# Altium project LM-003.PrjPcb (part 1 of 4)
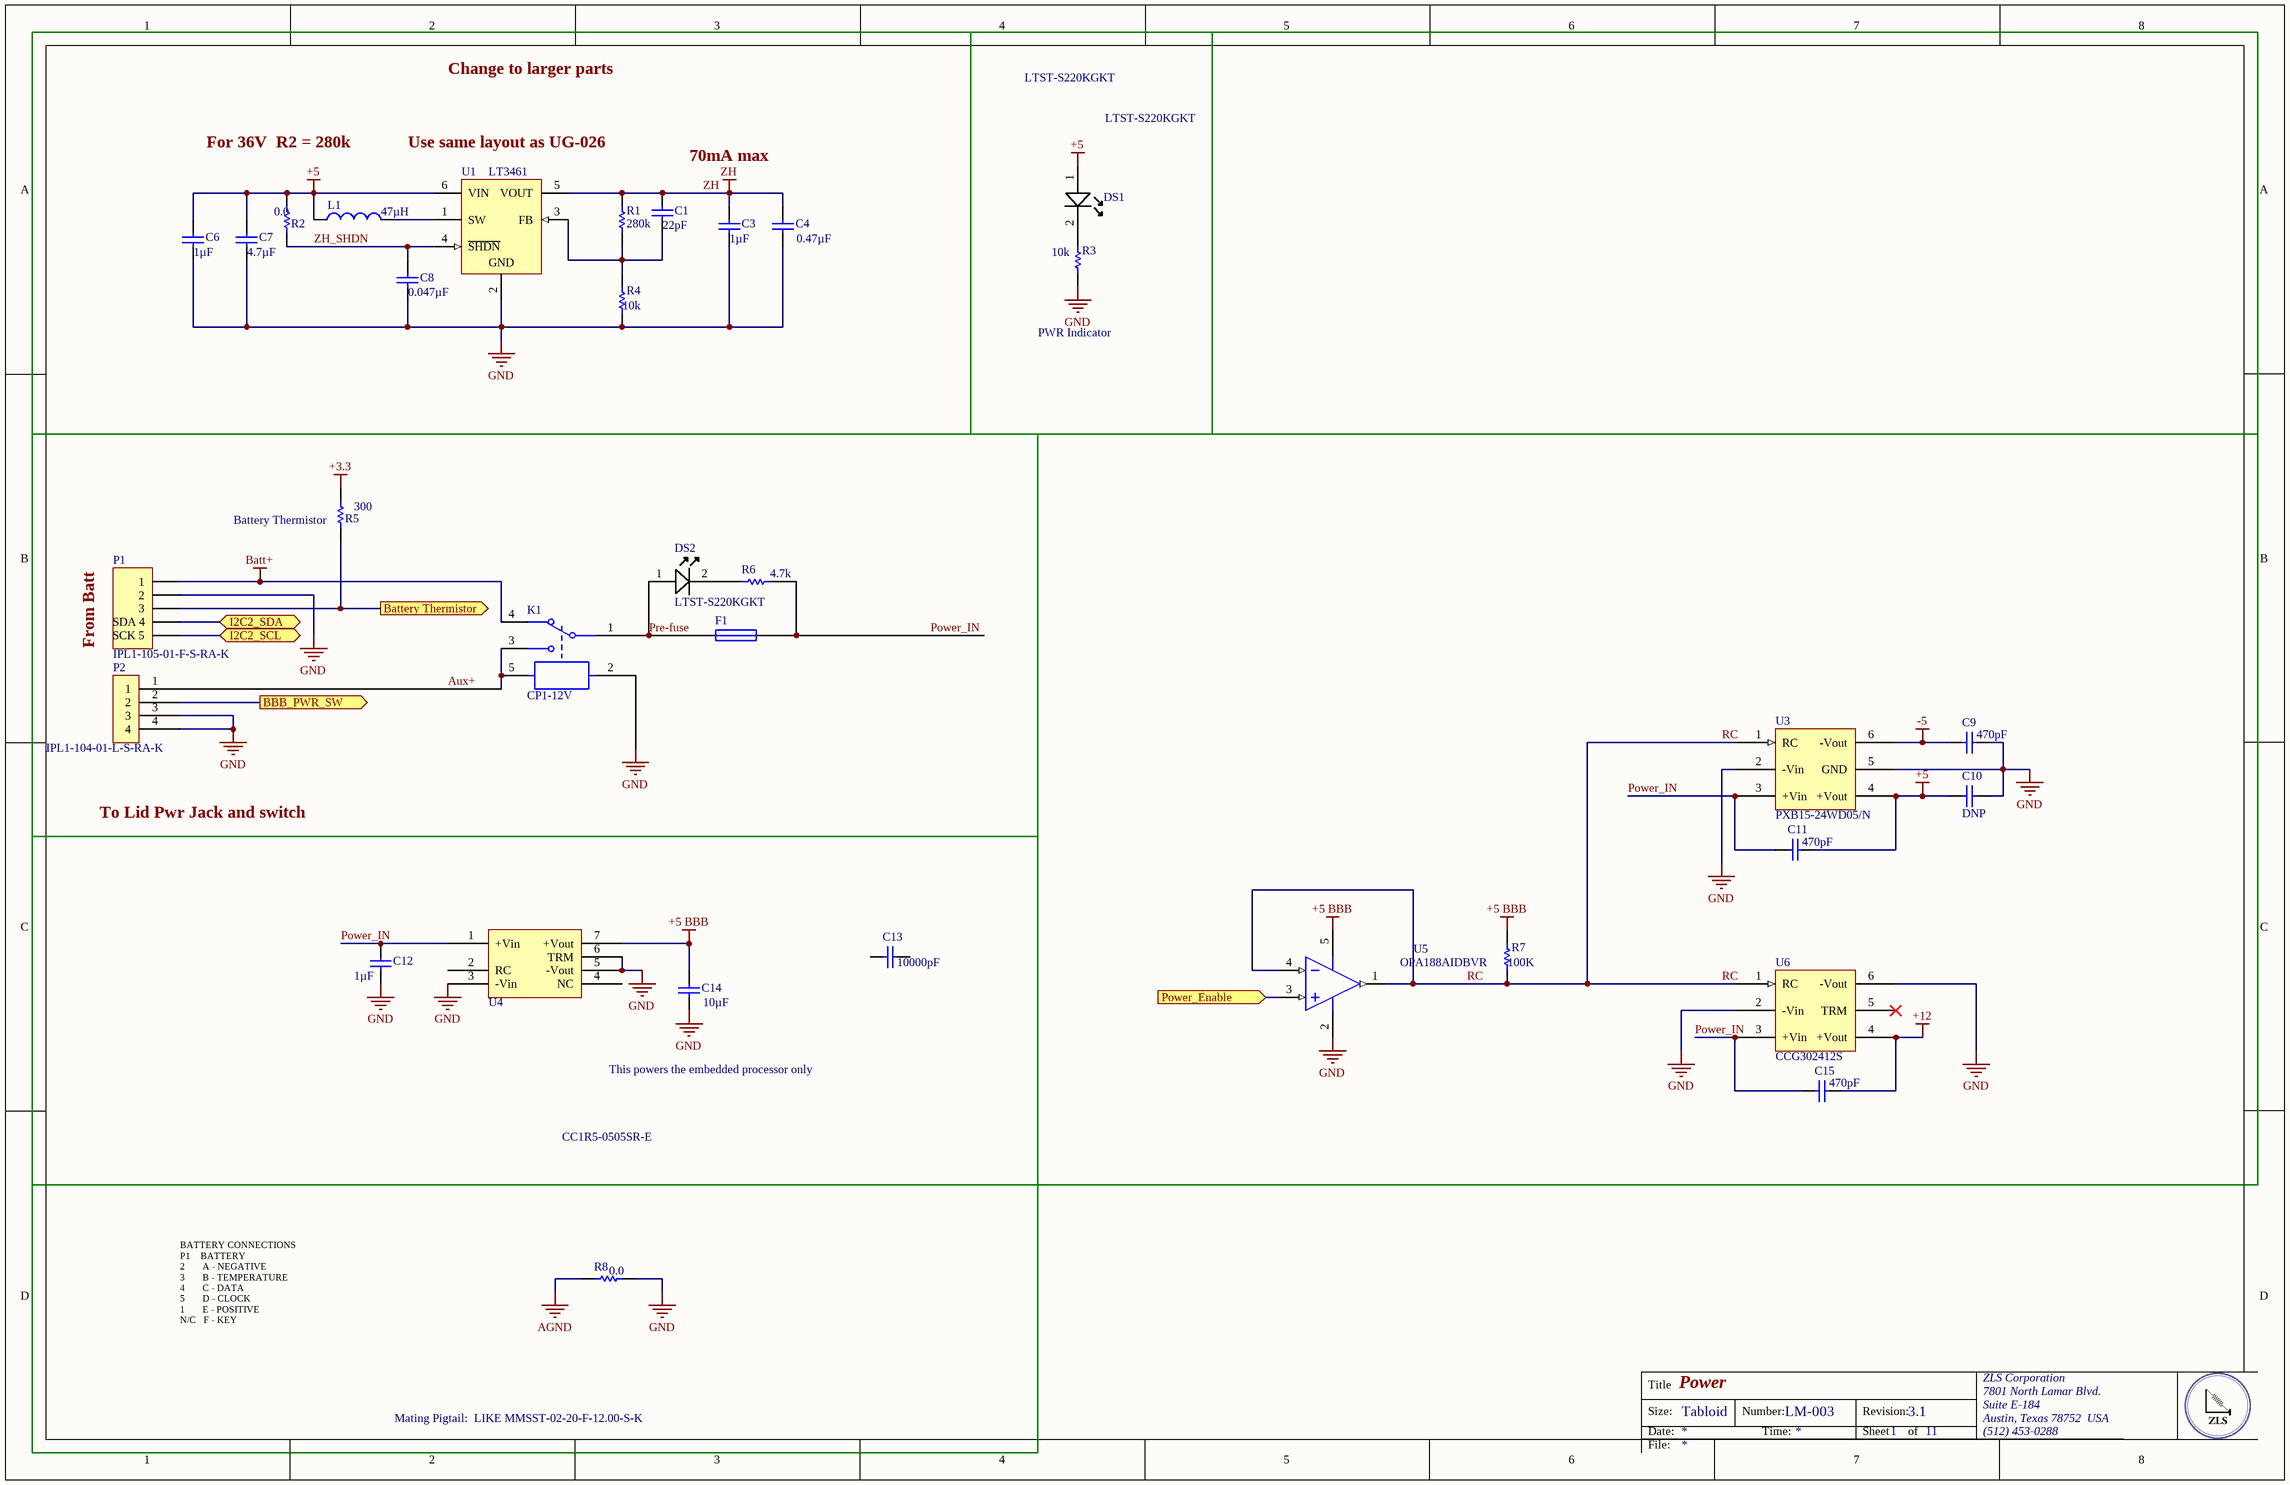
[diagram p0: Power.SchDoc]
9 sheets, 176 parts. Net scope: flat (ports and power ports of the same name join across sheets).
Board file: LM-003.PcbDoc
Sheets:
  Power.SchDoc
  FeedbackLoop.SchDoc
  ADC.SchDoc
  BBB Headers.SchDoc
  Connectors.SchDoc
  heater_control.SchDoc
  Power Monitor.SchDoc
  Real Time Clock.SchDoc
  RS232.SchDoc

## Sheet Power.SchDoc: Power
size Tabloid; DocumentNumber: LM-003; Revision: 3.1; SheetNumber: 1; SheetTotal: 11

### Parts
(Parts that share a designator on the sheet are numbered #1, #2 ... from top to bottom, then left to right.)
C1  Capacitance: 22pF  [CAPC0603(1608)100_N]  (hidden comment: CAP CER 22PF 50V X7R 0603)
C3  Capacitance: 1µF  [CAPC1210(3225)100_N]  (hidden comment: CAP CER 1UF 50V X7R 1210)
C4  Capacitance: 0.47µF  [CAPC1206(3216)190_N]  (hidden comment: CAP CER 0.47UF 50V X7R 1206)
C6  Capacitance: 1µF  [CAPC0805(2012)145_N]  (hidden comment: CAP CER 1UF 16V X7R 0805)
C7  Capacitance: 4.7µF  [CAPC1206(3216)130_N]  (hidden comment: CAP CER 4.7UF 16V X7R 1206)
C8  Capacitance: 0.047µF  [CAPC0805(2012)145_N]  (hidden comment: CAP CER 0.047UF 16V X7R 0603)
C9  Capacitance: 470pF  [CAPC1812(4532)230_M]  (hidden comment: CAP CER 470PF 3KV X7R 1812)
C10  DNP  [CAPC1812(4532)230_M]
C11  Capacitance: 470pF  [CAPC1812(4532)230_M]  (hidden comment: CAP CER 470PF 3KV X7R 1812)
C12  Capacitance: 1µF  [CAPC1210(3225)100_L]  (hidden comment: CAP CER 1UF 50V X7R 1210)
C13  Capacitance: 10000pF  [CAPC0805(2012)145_N]  (hidden comment: CAP CER 10000PF 25V X7R 0805)
C14#1  Capacitance: 10µF  [CAPC0805(2012)145_N]  (hidden comment: CAP CER 10UF 10V X7R 0805)
C15#1  Capacitance: 470pF  [CAPC1812(4532)230_M]  (hidden comment: CAP CER 470PF 3KV X7R 1812)
DS1  Manufacturer Part Number: LTST-S220KGKT  [0805C_L]  (hidden comment: Lite-On LTST-S220KGKT Green LED, 571 nm 2012 (0805) Side View, Rectangle Lens SMD package)
DS2  Manufacturer Part Number: LTST-S220KGKT  [0805C_L]  (hidden comment: Lite-On LTST-S220KGKT Green LED, 571 nm 2012 (0805) Side View, Rectangle Lens SMD package)
F1  Fuse 1  [PIN-W2/E2.8]  (value not drawn)
K1  CP1-12V  [PNSC-CP1-12V_V]
L1  Inductance: 47µH  [0402-A]  (hidden comment: FIXED IND 47UH 170MA 1.3 OHM SMD)
P1  IPL1-105-01-F-S-RA-K  [IPL1-105-1]
P2  IPL1-104-01-L-S-RA-K  [IPL1-104-01]
R1  Resistance (Ohms): 280k  [RESC0805(2012)_M]  (hidden comment: RES SMD 280K OHM 1% 1/8W 0805)
R2  Resistance (Ohms): 0.0  [RESC0805(2012)_M]  (hidden comment: RES SMD 0.0 OHM JUMPER 1/8W 0805)
R3  Resistance (Ohms): 10k  [RESC0805(2012)_M]  (hidden comment: RES SMD 10K OHM 1% 1/8W 0805)
R4  Resistance (Ohms): 10k  [RESC0805(2012)_M]  (hidden comment: RES SMD 10K OHM 1% 1/8W 0805)
R5  Resistance (Ohms): 300  [RESC0805(2012)_M]  (hidden comment: 300K 5% 0805(2012))
R6  Resistance (Ohms): 4.7k  [RESC0805(2012)_M]  (hidden comment: RES SMD 4.7K OHM 1% 1/8W 0805)
R7  Resistance: 100K  [RESC0805(2012)_M]  (hidden comment: RES SMD 100K OHM 1% 1/8W 0805)
R8  Resistance (Ohms): 0.0  [RESC0805(2012)_M]  (hidden comment: RES SMD 0.0 OHM JUMPER 1/8W 0805)
U1  LT3461  [LT-S6-6-TSOT-23_N]
U3  PXB15-24WD05/N  [PXB15-24WD05/N]
U4  CC1R5-0505SR-E  [CC1R5-0505SR-E]  (value not drawn)
U5  OPA188AIDBVR  [DBV0005A_M]
U6#1  CCG302412S  [CCG30]

### Blocks framed on the sheet
From Batt: DS2 F1 K1 P1 P2 R5 R6
To Lid Pwr Jack and switch: C12 C13 C14#1 U4
Mating Pigtail:  LIKE MMSST-02-20-F-12.00-S-K: R8

### Ports
Battery Thermistor (out), BBB_PWR_SW (out), I2C2_SCL, I2C2_SDA, Power_Enable (in)

### Nets
+3.3: R5.2
+5: C6.2 C7.2 C10.1 C11.2 DS1.1(A) L1.1 R2.1 U1.6(VIN) U3.4(+Vout)
+5 BBB: C14#1.2 R7.1 U4.7(+Vout) U5.5(V+)
+12: C15#1.2 U6#1.4(+Vout)
-5: C9.1 U3.6(-Vout)
AGND: R8.2
Batt+: K1.4 P1.1
GND: C3.1 C4.1 C6.1 C7.1 C8.1 C9.2 C10.2 C12.1 C14#1.1 K1.2 P1.2 P2.3 P2.4 R3.1 R4.2 R8.1 U1.2(GND) U3.2(-Vin) U3.5(GND) U4.3(-Vin) U4.5(-Vout) U4.6(TRM) U5.2(V-) U6#1.2(-Vin) U6#1.6(-Vout)
ZH: C1.2 C3.2 C4.2 R1.1 U1.5(VOUT)
Aux+: K1.3 K1.5 P2.1
Power_IN: C11.1 C12.2 C15#1.1 F1.2 R6.1 U3.3(+Vin) U4.1(+Vin) U6#1.3(+Vin)
Pre-fuse: DS2.1(A) F1.1 K1.1
RC: R7.2 U3.1(RC) U5.1(OUT) U5.4(IN-) U6#1.1(RC)
ZH_SHDN: C8.2 R2.2 U1.4(~{SHDN})
NetC1_1: C1.1 R1.2 R4.1 U1.3(FB)
NetDS1_2: DS1.2(K) R3.2
NetDS2_2: DS2.2(K) R6.2
NetL1_2: L1.2 U1.1(SW)
NetP1_3: P1.3 R5.1 ; port Battery Thermistor
NetP1_4: P1.4(SDA_4) ; port I2C2_SDA
NetP1_5: P1.5(SCK_5) ; port I2C2_SCL
NetP2_2: P2.2 ; port BBB_PWR_SW
NetU5_3: U5.3(IN+) ; port Power_Enable

Not connected (* = marked no-connect by the designer): C13 1 2; U4 2(RC) 4(NC); U6#1 5(TRM)*

### Notes on the sheet
- Change to larger parts
- LTST-S220KGKT
- For 36V  R2 = 280k
- Use same layout as UG-026
- 70mA max
- PWR Indicator
- (near R5) Battery Thermistor
- This powers the embedded processor only
- CC1R5-0505SR-E
- BATTERY CONNECTIONS
  P1    BATTERY
  2       A - NEGATIVE
  3       B - TEMPERATURE
  4       C - DATA
  5       D - CLOCK
  1       E - POSITIVE
  N/C   F - KEY
- Title
- Size:
- Date:
- Tabloid
- Number:
- Time:
- Revision:
- Sheet
- of
- ZLS Corporation
- 7801 North Lamar Blvd.
- Suite E-184
- Austin, Texas 78752  USA
- (512) 453-0288
- File:

### Library data of the parts
C1 = CMP-1035-00578-1: Manufacturer: AVX Corporation; Manufacturer Part Number: 06035C220JAT2A; Tolerance: ±5%; Supplier 1: Digi-Key; Supplier Part Number 1: 478-6204-6-ND; RoHS: RoHS Compliant; Category: Capacitors; Stock 1: 72942; Pricing 1: 1=0.2, 10=0.136, 100=0.0688, 1000=0.04166 (USD); Packaging: Digi-Reel®; Part Status: Active; Voltage - Rated: 50V; Temperature Coefficient: X7R; Operating Temperature: -55°C ~ 125°C; Features: -; Ratings: -; Applications: General Purpose; Mounting Type: Surface Mount, MLCC; Package / Case: 0603 (1608 Metric); Size / Dimension: 0.063" L x 0.032" W (1.60mm x 0.81mm); Height - Seated (Max): -; Thickness (Max): 0.035" (0.90mm); Lead Spacing: -; Lead Style: -; ComponentLink1URL: http://datasheets.avx.com/X7RDielectric.pdf; ComponentLink1Description: http://datasheets.avx.com/X7RDielectric.pdf
C3 = CMP-1038-01123-1: Manufacturer: Taiyo Yuden; Manufacturer Part Number: UMK325B7105KH-T; Tolerance: ±10%; Supplier 1: Digi-Key; Supplier Part Number 1: 587-1366-1-ND; RoHS: RoHS Compliant; Category: Capacitors; Stock 1: 23864; Pricing 1: 1=0.36, 10=0.247, 100=0.1398, 500=0.0987, 1000=0.08637 (USD); Packaging: Cut Tape (CT); Part Status: Active; Voltage - Rated: 50V; Temperature Coefficient: X7R; Operating Temperature: -55°C ~ 125°C; Features: -; Ratings: -; Applications: General Purpose; Mounting Type: Surface Mount, MLCC; Package / Case: 1210 (3225 Metric); Size / Dimension: 0.126" L x 0.098" W (3.20mm x 2.50mm); Height - Seated (Max): -; Thickness (Max): 0.063" (1.60mm); Lead Spacing: -; Lead Style: -; ComponentLink1URL: http://www.yuden.co.jp/productdata/catalog/en/mlcc_all_e.pdf; ComponentLink1Description: http://www.yuden.co.jp/productdata/catalog/en/mlcc_all_e.pdf
C4 = CMP-1037-04570-1: Manufacturer: Taiyo Yuden; Manufacturer Part Number: UMK316B7474KL-T; Tolerance: ±10%; Supplier 1: Digi-Key; Supplier Part Number 1: 587-1325-1-ND; RoHS: RoHS Compliant; Category: Capacitors; Stock 1: 8658; Pricing 1: 1=0.3, 10=0.203, 100=0.115, 500=0.08114, 1000=0.071 (USD); Packaging: Cut Tape (CT); Part Status: Active; Voltage - Rated: 50V; Temperature Coefficient: X7R; Operating Temperature: -55°C ~ 125°C; Features: -; Ratings: -; Applications: General Purpose; Mounting Type: Surface Mount, MLCC; Package / Case: 1206 (3216 Metric); Size / Dimension: 0.126" L x 0.063" W (3.20mm x 1.60mm); Height - Seated (Max): -; Thickness (Max): 0.071" (1.80mm); Lead Spacing: -; Lead Style: -; ComponentLink1URL: http://www.yuden.co.jp/productdata/catalog/en/mlcc_all_e.pdf; ComponentLink1Description: http://www.yuden.co.jp/productdata/catalog/en/mlcc_all_e.pdf
C6 = CMP-1036-04795-1: Manufacturer: Taiyo Yuden; Manufacturer Part Number: EMK212B7105KG-T; Tolerance: ±10%; Supplier 1: Digi-Key; Supplier Part Number 1: 587-1283-1-ND; RoHS: RoHS Compliant; Category: Capacitors; Stock 1: 41495; Pricing 1: 1=0.13, 10=0.089, 100=0.042, 1000=0.02439 (USD); Packaging: Cut Tape (CT); Part Status: Active; Voltage - Rated: 16V; Temperature Coefficient: X7R; Operating Temperature: -55°C ~ 125°C; Features: -; Ratings: -; Applications: General Purpose; Mounting Type: Surface Mount, MLCC; Package / Case: 0805 (2012 Metric); Size / Dimension: 0.079" L x 0.049" W (2.00mm x 1.25mm); Height - Seated (Max): -; Thickness (Max): 0.053" (1.35mm); Lead Spacing: -; Lead Style: -; ComponentLink1URL: http://ds.yuden.co.jp/TYCOMPAS/ut/detail.do?productNo=EMK212B7105KG-T&fileName=EMK212B7105KG-T_SS&mode=specSheetDownload; ComponentLink1Description: http://ds.yuden.co.jp/TYCOMPAS/ut/detail.do?productNo=EMK212B7105KG-T&fileName=EMK212B7105KG-T_SS&mode=specSheetDownload
C7 = CMP-1037-04913-1: Manufacturer: Taiyo Yuden; Manufacturer Part Number: EMK316B7475KL-T; Tolerance: ±10%; Supplier 1: Digi-Key; Supplier Part Number 1: 587-1331-6-ND; RoHS: RoHS Compliant; Category: Capacitors; Stock 1: 59490; Pricing 1: 1=0.25, 10=0.17, 100=0.0965, 1000=0.0596 (USD); Packaging: Digi-Reel®; Part Status: Active; Voltage - Rated: 16V; Temperature Coefficient: X7R; Operating Temperature: -55°C ~ 125°C; Features: -; Ratings: -; Applications: General Purpose; Mounting Type: Surface Mount, MLCC; Package / Case: 1206 (3216 Metric); Size / Dimension: 0.126" L x 0.063" W (3.20mm x 1.60mm); Height - Seated (Max): -; Thickness (Max): 0.071" (1.80mm); Lead Spacing: -; Lead Style: -; ComponentLink1URL: http://ds.yuden.co.jp/TYCOMPAS/ut/detail.do?productNo=EMK316B7475KL-T&fileName=EMK316B7475KL-T_SS&mode=specSheetDownload; ComponentLink1Description: http://ds.yuden.co.jp/TYCOMPAS/ut/detail.do?productNo=EMK316B7475KL-T&fileName=EMK316B7475KL-T_SS&mode=specSheetDownload
C8 = CMP-1036-04795-1: Manufacturer: Murata Electronics North America; Manufacturer Part Number: GRM188R71C473KA01D; Tolerance: ±10%; Supplier 1: Digi-Key; Supplier Part Number 1: 490-1529-6-ND; RoHS: RoHS Compliant; Category: Capacitors; Stock 1: 26; Pricing 1: 1=0.1, 10=0.046, 100=0.0206, 500=0.0147, 1000=0.01155 (USD); Packaging: Digi-Reel®; Part Status: Active; Voltage - Rated: 16V; Temperature Coefficient: X7R; Operating Temperature: -55°C ~ 125°C; Features: -; Ratings: -; Applications: General Purpose; Mounting Type: Surface Mount, MLCC; Package / Case: 0603 (1608 Metric); Size / Dimension: 0.063" L x 0.031" W (1.60mm x 0.80mm); Height - Seated (Max): -; Thickness (Max): 0.035" (0.90mm); Lead Spacing: -; Lead Style: -; ComponentLink1URL: http://www.murata.com/~/media/webrenewal/support/library/catalog/products/capacitor/mlcc/c02e.ashx; ComponentLink1Description: http://www.murata.com/~/media/webrenewal/support/library/catalog/products/capacitor/mlcc/c02e.ashx
C9 C11 C15#1 = CMP-1040-00561-1: Manufacturer: Kemet; Manufacturer Part Number: C1812C471KHRACTU; Tolerance: 10%; Supplier 1: Digi-Key; Supplier Part Number 1: 399-7289-6-ND; Stock 1: 2705; Pricing 1: 1=0.88, 10=0.666, 100=0.4761 (USD); Case/Package: 1812; Case Code (Metric): 4532; Case Code (Imperial): 1812; Min Operating Temperature: -55°C; Max Operating Temperature: 125°C; Voltage Rating: 3kV; Packaging: Tape and Reel; Package Quantity: 1; Voltage Rating (DC): 3kV; Length: 0.177inch; Width: 0.126inch; Thickness: 0.071inch; Lead Free: Lead Free; ComponentLink1URL: http://www.kemet.com/docfinder?Partnumber=C1812C471KHRACTU; ComponentLink1Description: http://www.kemet.com/docfinder?Partnumber=C1812C471KHRACTU
C10 = CMP-1040-00561-1: CAP CER 470PF 3KV X7R 1812; Manufacturer: Kemet; Manufacturer Part Number: C1812C471KHRACTU; Tolerance: 10%; Supplier 1: Digi-Key; Supplier Part Number 1: 399-7289-6-ND; Stock 1: 2705; Pricing 1: 1=0.88, 10=0.666, 100=0.4761 (USD); Case/Package: 1812; Case Code (Metric): 4532; Case Code (Imperial): 1812; Min Operating Temperature: -55°C; Max Operating Temperature: 125°C; Capacitance: 470pF; Voltage Rating: 3kV; Packaging: Tape and Reel; Package Quantity: 1; Voltage Rating (DC): 3kV; Length: 0.177inch; Width: 0.126inch; Thickness: 0.071inch; Lead Free: Lead Free; ComponentLink1URL: http://www.kemet.com/docfinder?Partnumber=C1812C471KHRACTU; ComponentLink1Description: http://www.kemet.com/docfinder?Partnumber=C1812C471KHRACTU
C12 = CMP-1038-00632-1: Manufacturer: Murata Electronics North America; Manufacturer Part Number: GRM32RR71H105KA01L; Tolerance: ±10%; Supplier 1: Digi-Key; Supplier Part Number 1: 490-1863-6-ND; RoHS: RoHS Compliant; Category: Capacitors; Stock 1: 66890; Pricing 1: 1=0.35, 10=0.242, 100=0.1449, 500=0.10868 (USD); Packaging: Digi-Reel®; Part Status: Active; Voltage - Rated: 50V; Temperature Coefficient: X7R; Operating Temperature: -55°C ~ 125°C; Features: -; Ratings: -; Applications: General Purpose; Mounting Type: Surface Mount, MLCC; Package / Case: 1210 (3225 Metric); Size / Dimension: 0.126" L x 0.098" W (3.20mm x 2.50mm); Height - Seated (Max): -; Thickness (Max): 0.079" (2.00mm); Lead Spacing: -; Lead Style: -; ComponentLink1URL: http://search.murata.co.jp/Ceramy/image/img/A01X/G101/ENG/GRM32RR71H105KA01-01.pdf; ComponentLink1Description: http://search.murata.co.jp/Ceramy/image/img/A01X/G101/ENG/GRM32RR71H105KA01-01.pdf
C13 = CMP-1036-04795-1: Manufacturer: Murata Electronics North America; Manufacturer Part Number: GRM216R71E103KA01D; Tolerance: ±10%; Supplier 1: Digi-Key; Supplier Part Number 1: 490-12748-6-ND; RoHS: RoHS Compliant; Category: Capacitors; Stock 1: 13127; Pricing 1: 1=0.11, 10=0.077, 100=0.0343, 500=0.02452, 1000=0.01926 (USD); Packaging: Digi-Reel®; Part Status: Active; Voltage - Rated: 25V; Temperature Coefficient: X7R; Operating Temperature: -55°C ~ 125°C; Features: -; Ratings: -; Applications: General Purpose; Mounting Type: Surface Mount, MLCC; Package / Case: 0805 (2012 Metric); Size / Dimension: 0.079" L x 0.049" W (2.00mm x 1.25mm); Height - Seated (Max): -; Thickness (Max): 0.028" (0.70mm); Lead Spacing: -; Lead Style: -; ComponentLink1URL: http://www.murata.com/~/media/webrenewal/support/library/catalog/products/capacitor/mlcc/c02e.ashx; ComponentLink1Description: http://www.murata.com/~/media/webrenewal/support/library/catalog/products/capacitor/mlcc/c02e.ashx
C14#1 = CMP-1036-04795-1: Manufacturer: Murata Electronics North America; Manufacturer Part Number: GCM21BR71A106KE22L; Tolerance: ±10%; Supplier 1: Digi-Key; Supplier Part Number 1: 490-10674-6-ND; RoHS: RoHS Compliant; Category: Capacitors; Stock 1: 136726; Pricing 1: 1=0.49, 10=0.347, 100=0.2282, 500=0.16906, 1000=0.14369 (USD); Packaging: Digi-Reel®; Part Status: Active; Voltage - Rated: 10V; Temperature Coefficient: X7R; Operating Temperature: -55°C ~ 125°C; Features: -; Ratings: AEC-Q200; Applications: Automotive; Mounting Type: Surface Mount, MLCC; Package / Case: 0805 (2012 Metric); Size / Dimension: 0.079" L x 0.049" W (2.00mm x 1.25mm); Height - Seated (Max): -; Thickness (Max): 0.055" (1.40mm); Lead Spacing: -; Lead Style: -; ComponentLink1URL: http://search.murata.co.jp/Ceramy/image/img/A01X/G101/ENG/GCM21BR71A106KE22-01.pdf; ComponentLink1Description: http://search.murata.co.jp/Ceramy/image/img/A01X/G101/ENG/GCM21BR71A106KE22-01.pdf
DS1 DS2 = LED A/K: Manufacturer: Vishay / Lite-On; Lens Colour: Colorless; Viewing Angle: 130°; Luminous Intensity: 35mcd; Forward Current: 20mA; Forward Voltage: 2V; Lens Style: Diffused,Colorless; Power Rating: 75mW; Dominant Wavelength: 568nm; Lens Transparency: Clear; Number of Elements: 1; Power Dissipation: 75W; Wavelength: 574nm; Supplier 1: Digi-Key; Supplier Part Number 1: 160-1468-1-ND; Stock 1: 74800; Pricing 1: 1=0.29, 10=0.212, 25=0.1564, 100=0.1117, 250=0.0759, 500=0.067, 1000=0.0525 (USD); Mount: Surface Mount; Case/Package: 0805; Number of Pins: 2; Colour: Green; Case Code (Metric): 2012; Case Code (Imperial): 0805; Min Operating Temperature: -55°C; Max Operating Temperature: 85°C; Packaging: Tape and Reel; Package Quantity: 4000; Illumination Colour: Green; Test Current: 20mA; Number of LEDs: 1; Length: 2.1mm; Height: 0.6mm; Width: 1mm; Depth: 0.6mm; Radiation Hardening: No; Lead Free: Lead Free; ComponentLink1URL: https://datasheet.ciiva.com/11775/0900766b80dc0b70-11775441.pdf; ComponentLink1Description: https://datasheet.ciiva.com/11775/0900766b80dc0b70-11775441.pdf; ComponentLink2URL: https://datasheet.ciiva.com/2110/s-110-ltst-s220kgkt-2110069.pdf; ComponentLink2Description: https://datasheet.ciiva.com/2110/s-110-ltst-s220kgkt-2110069.pdf; ComponentLink3URL: https://datasheet.ciiva.com/2110/s-110-ltst-s220kgkt-2110070.pdf; ComponentLink3Description: https://datasheet.ciiva.com/2110/s-110-ltst-s220kgkt-2110070.pdf; ComponentLink4URL: https://datasheet.ciiva.com/12400/100-ltst-s220kgkt-59602-12400886.pdf; ComponentLink4Description: https://datasheet.ciiva.com/12400/100-ltst-s220kgkt-59602-12400886.pdf; ComponentLink5URL: https://datasheet.ciiva.com/2110/s-110-ltst-s220kgkt-2110071.pdf; ComponentLink5Description: https://datasheet.ciiva.com/2110/s-110-ltst-s220kgkt-2110071.pdf; ComponentLink6URL: https://datasheet.ciiva.com/16379/ltst-s220kgkt-16379082.pdf; ComponentLink6Description: https://datasheet.ciiva.com/16379/ltst-s220kgkt-16379082.pdf
  DS2: Supplier 2: Farnell; Supplier Part Number 2: 2062310; RoHS: YES; Stock 2: 2271; Pricing 2: 1=0.325, 10=0.317, 100=0.23, 200=0.228, 400=0.182, 900=0.147, 3000=0.114, 9000=0.107 (GBP); ComponentLink7URL: http://www.farnell.com/cad/2124774.pdf; ComponentLink7Description: http://www.farnell.com/cad/2124774.pdf; ComponentLink8URL: http://www.farnell.com/datasheets/693084.pdf; ComponentLink8Description: http://www.farnell.com/datasheets/693084.pdf
F1 = Fuse 1: Fuse; Published: 8-Jun-2000; LatestRevisionDate: 17-Jul-2002; LatestRevisionNote: Re-released for DXP Platform.; PackageReference: PIN-W2/E2.8; Publisher: Altium Limited; PackageDescription: Thru-Hole; 2 Leads
K1 = CMP-2000-06116-1: 1 Form C SPDT Relay, 12 VDC, 40 A, -40 to 85 degC, 5-Pin THD, RoHS, Tube; Manufacturer: Panasonic; Contact Form: SPDT(1FormC); Turn On Voltage (Max): 7.2VDC; Coil Voltage: 12VDC; Other Names: 255-1939CP1-12V-NDCP112V; Turn Off Voltage (Min): 1VDC; Online Catalog: CPSeries; Coil Current: 53.3mA; Contact Rating (Current): 20A; Relay Type: Automotive; Catalog Drawings: CPSeriesPCBCP1-12VFootprintCP1-12VCircuit; Coil Power: 640mW; Coil Type: NonLatching; Operate Time: 10ms; Coil Resistance: 225Ohms; Other Related Documents: GeneralApplGuidelinesHowtoReadDateCodes; Switching Voltage: 14VDC-Nom; EDA / CAD Models: DownloadfromAcceleratedDesigns; Features: Sealed-Fully; Mounting Type: ThroughHole; Contact Material: SilverAlloy,CadmiumFree; Category: Relays; Datasheet Version: 12/2012; Termination Style: PCPin; Package Description: 5-Pin Through Hole Device, Body 14 x 13 mm, Height 9.5 mm; Standard Package: 40; Packaging: Tube; Family: PowerRelays,Over2Amps; Release Time: 10ms; Mounting Technology: ThroughHole; Datasheet URL: https://www.panasonic-electric-works.com/pew/de/downloads/ds_61207_en_cp.pdf; Series: CP; Manufacturer URL: http://www.panasonic.com/; Package Reference: CP1-12V; Operating Temperature: -40°C~85°C
L1 = Inductor: Manufacturer 1: Murata Electronics North America; Manufacturer Part Number 1: LQH32CN470K23L; Category 1: Inductors, Coils, Chokes; Type: Wirewound; Material - Core: Ferrite; Tolerance: ±10%; Shielding: Unshielded; DC Resistance (DCR): 1.3 Ohm; Frequency - Self Resonant: 15MHz; Frequency - Test: 1MHz; Supplier 1: Digi-Key; Supplier Part Number 1: 490-2497-1-ND; RoHS 1: RoHS Compliant; Description 1: FIXED IND 47UH 170MA 1.3 OHM SMD; Stock 1: 39785; Pricing 1: 1=0.32, 10=0.291, 25=0.2584, 50=0.2262, 100=0.21, 250=0.1938, 500=0.18412, 750=0.16796, 1000=0.14858 (USD); Packaging: Cut Tape (CT); Current Rating: 170mA; Current - Saturation: -; Q @ Freq: -; Operating Temperature: -40°C ~ 85°C; Mounting Type: Surface Mount; Package / Case: 1210 (3225 Metric); Size / Dimension: 0.126" L x 0.098" W (3.20mm x 2.50mm); Height - Seated (Max): 0.067" (1.70mm); Supplier Device Package: 1210; ComponentLink1URL: http://search.murata.co.jp/Ceramy/image/img/PDF/ENG/L0075S0093LQH32C_23~33.pdf; ComponentLink1Description: http://search.murata.co.jp/Ceramy/image/img/PDF/ENG/L0075S0093LQH32C_23~33.pdf
P1 = Header 5H: Header, 5-Pin, Right Angle; Manufacturer 1: Samtec Inc.; Description 1: .100 TERMINAL ASSEMBLY; Category 1: Connectors, Interconnects; Pitch - Mating: 0.100" (2.54mm); Style: Board to Cable/Wire; Shrouding: Shrouded - 4 Wall; Number of Positions: 5; Number of Positions Loaded: All; Contact Length - Mating: 0.215" (5.46mm); Contact Length - Post: 0.085" (2.16mm); Material Flammability Rating: UL94 V-0; Voltage Rating: 675VAC, 954VDC; Supplier 1: Digi-Key; Supplier Part Number 1: IPL1-105-01-F-S-RA-K-ND; Manufacturer Part Number 1: IPL1-105-01-F-S-RA-K; RoHS 1: RoHS Compliant; Stock 1: 0; Pricing 1: 1=2.46 (USD); Packaging: Tube; Part Status: Active; Connector Type: Header; Contact Type: Male Pin; Number of Rows: 1; Row Spacing - Mating: -; Mounting Type: Through Hole, Right Angle; Termination: Solder; Fastening Type: Locking Ramp; Overall Contact Length: -; Insulation Height: 0.240" (6.10mm); Contact Shape: Square; Contact Finish - Mating: Gold; Contact Finish Thickness - Mating: 3µin (0.08µm); Contact Finish - Post: Tin; Contact Material: Phosphor Bronze; Insulation Material: Liquid Crystal Polymer (LCP); Features: -; Operating Temperature: -55°C ~ 125°C; Ingress Protection: -; Insulation Color: Natural; Current Rating: -; Mated Stacking Heights: -; Contact Finish Thickness - Post: -; Applications: -; ComponentLink1URL: http://suddendocs.samtec.com/prints/ipl1-1xx-xx-xxx-s-xx-x-xx-mkt.pdf; ComponentLink1Description: http://suddendocs.samtec.com/prints/ipl1-1xx-xx-xxx-s-xx-x-xx-mkt.pdf
P2 = 53047-0410: .100 TERMINAL ASSY; Manufacturer 1: Samtec Inc.; Category 1: Connectors, Interconnects; Connector Type: Header; Pitch - Mating: 0.100" (2.54mm); Style: Board to Cable/Wire; Shrouding: Shrouded - 4 Wall; Number of Positions: 4; Number of Positions Loaded: All; Contact Length - Mating: 0.215" (5.46mm); Contact Length - Post: 0.085" (2.16mm); Material Flammability Rating: UL94 V-0; Voltage Rating: 675VAC, 954VDC; Supplier 1: Digi-Key; Supplier Part Number 1: SAM9597-ND; Manufacturer Part Number 1: IPL1-104-01-L-S-RA-K; RoHS 1: RoHS Compliant; Description 1: .100 TERMINAL ASSY; Stock 1: 100; Pricing 1: 1=2.53, 10=2.424, 25=2.222, 50=2.121, 100=2.02, 250=1.76752, 500=1.717, 1000=1.4645, 2500=1.3635 (USD); Packaging: Tube; Part Status: Active; Contact Type: Male Pin; Number of Rows: 1; Row Spacing - Mating: -; Mounting Type: Through Hole, Right Angle; Termination: Solder; Fastening Type: Locking Ramp; Overall Contact Length: -; Insulation Height: 0.240" (6.10mm); Contact Shape: Square; Contact Finish - Mating: Gold; Contact Finish Thickness - Mating: 10µin (0.25µm); Contact Finish - Post: Tin; Contact Material: Phosphor Bronze; Insulation Material: Liquid Crystal Polymer (LCP); Features: -; Operating Temperature: -55°C ~ 125°C; Ingress Protection: -; Insulation Color: Natural; Current Rating: -; Mated Stacking Heights: -; Contact Finish Thickness - Post: -; Applications: -; ComponentLink1URL: http://suddendocs.samtec.com/prints/ipl1-1xx-xx-xxx-s-xx-x-xx-mkt.pdf; ComponentLink1Description: http://suddendocs.samtec.com/prints/ipl1-1xx-xx-xxx-s-xx-x-xx-mkt.pdf
R1 = CMP-1013-00017-1: Manufacturer: Vishay Dale; Manufacturer Part Number: CRCW0805280KFKEA; Power (Watts): 0.125W, 1/8W; Temperature Coefficient: ±100ppm/°C; Supplier 1: Digi-Key; Supplier Part Number 1: 541-280KCTR-ND; RoHS: RoHS Compliant; Category: Resistors; Stock 1: 10000; Pricing 1: 5000=0.00546, 10000=0.00474, 25000=0.00417, 50000=0.00382, 125000=0.00375 (USD); Packaging: Tape & Reel (TR); Part Status: Active; Tolerance: ±1%; Composition: Thick Film; Features: Automotive AEC-Q200; Operating Temperature: -55°C ~ 155°C; Package / Case: 0805 (2012 Metric); Supplier Device Package: 0805; Size / Dimension: 0.079" L x 0.049" W (2.00mm x 1.25mm); Height - Seated (Max): 0.020" (0.50mm); Failure Rate: -; ComponentLink1URL: http://www.vishay.com/docs/20035/dcrcwe3.pdf; ComponentLink1Description: http://www.vishay.com/docs/20035/dcrcwe3.pdf
R2 R8 = CMP-1013-00017-1: Manufacturer: Vishay Dale; Manufacturer Part Number: CRCW08050000Z0EA; Power (Watts): 0.125W, 1/8W; Supplier 1: Digi-Key; RoHS: RoHS Compliant; Category: Resistors; Pricing 1: 1=0.1, 10=0.026, 25=0.0184, 50=0.014, 100=0.0104, 250=0.00792, 500=0.00634, 1000=0.00466 (USD); Part Status: Active; Tolerance: Jumper; Composition: Thick Film; Features: Automotive AEC-Q200; Temperature Coefficient: -; Operating Temperature: -55°C ~ 155°C; Package / Case: 0805 (2012 Metric); Supplier Device Package: 0805; Size / Dimension: 0.079" L x 0.049" W (2.00mm x 1.25mm); Height - Seated (Max): 0.020" (0.50mm); Failure Rate: -; ComponentLink1URL: http://www.vishay.com/docs/20035/dcrcwe3.pdf; ComponentLink1Description: http://www.vishay.com/docs/20035/dcrcwe3.pdf
  R2: Supplier Part Number 1: 541-0.0ACT-ND; Stock 1: 117072; Packaging: Cut Tape (CT)
  R8: Supplier Part Number 1: 541-0.0ADKR-ND; Stock 1: 406953; Packaging: Digi-Reel®
R3 = CMP-1013-00017-1: Manufacturer: Vishay Dale; Manufacturer Part Number: CRCW080510K0FKTA; Power (Watts): 0.125W, 1/8W; Temperature Coefficient: ±100ppm/°C; Supplier 1: Digi-Key; Supplier Part Number 1: 541-3016-6-ND; RoHS: RoHS non-compliant; Category: Resistors; Stock 1: 5348; Pricing 1: 1=0.14, 10=0.129, 100=0.0496, 1000=0.02183, 2500=0.01885 (USD); Packaging: Digi-Reel®; Part Status: Active; Tolerance: ±1%; Composition: Thick Film; Features: Automotive AEC-Q200; Operating Temperature: -55°C ~ 155°C; Package / Case: 0805 (2012 Metric); Supplier Device Package: 0805; Size / Dimension: 0.079" L x 0.049" W (2.00mm x 1.25mm); Height - Seated (Max): 0.020" (0.50mm); Failure Rate: -; ComponentLink1URL: http://www.vishay.com/docs/20008/dcrcw.pdf; ComponentLink1Description: http://www.vishay.com/docs/20008/dcrcw.pdf
R4 = CMP-1013-00017-1: Manufacturer: Yageo; Manufacturer Part Number: RC0805FR-0710KL; Power (Watts): 0.125W, 1/8W; Temperature Coefficient: ±100ppm/°C; Supplier 1: Digi-Key; Supplier Part Number 1: 311-10.0KCRCT-ND; RoHS: RoHS Compliant; Category: Resistors; Stock 1: 13336570; Pricing 1: 1=0.1, 10=0.022, 100=0.0088, 1000=0.00396, 2500=0.00344 (USD); Packaging: Cut Tape (CT); Part Status: Active; Tolerance: ±1%; Composition: Thick Film; Features: Moisture Resistant; Operating Temperature: -55°C ~ 155°C; Package / Case: 0805 (2012 Metric); Supplier Device Package: 0805; Size / Dimension: 0.079" L x 0.049" W (2.00mm x 1.25mm); Height - Seated (Max): 0.024" (0.60mm); Failure Rate: -; ComponentLink1URL: http://www.yageo.com/documents/recent/PYu-RC_Group_51_RoHS_L_7.pdf; ComponentLink1Description: http://www.yageo.com/documents/recent/PYu-RC_Group_51_RoHS_L_7.pdf
R5 = CMP-1013-00133-1: 300K 0.125W 5% 0805 (2012 Metric)  SMD; Manufacturer: Vishay Dale; Manufacturer Part Number: CRCW0805300RFKEA; Tolerance: ±1%; Power (Watts): 0.125W, 1/8W; Temperature Coefficient: ±100ppm/°C; Supplier 1: Digi-Key; Supplier Part Number 1: 541-300CCT-ND; RoHS: RoHS Compliant; Category: Resistors; Stock 1: 79765; Pricing 1: 1=0.1, 10=0.044, 100=0.0178, 1000=0.00802, 2500=0.00696 (USD); Packaging: Cut Tape (CT); Part Status: Active; Composition: Thick Film; Features: Automotive AEC-Q200; Operating Temperature: -55°C ~ 155°C; Package / Case: 0805 (2012 Metric); Supplier Device Package: 0805; Size / Dimension: 0.079" L x 0.049" W (2.00mm x 1.25mm); Height - Seated (Max): 0.020" (0.50mm); Failure Rate: -; ComponentLink1URL: http://www.vishay.com/docs/20035/dcrcwe3.pdf; ComponentLink1Description: http://www.vishay.com/docs/20035/dcrcwe3.pdf
R6 = CMP-1013-00017-1: Manufacturer: Vishay Dale; Manufacturer Part Number: CRCW08054K70FKEA; Power (Watts): 0.125W, 1/8W; Temperature Coefficient: ±100ppm/°C; Supplier 1: Digi-Key; Supplier Part Number 1: 541-4.70KCDKR-ND; RoHS: RoHS Compliant; Category: Resistors; Stock 1: 0; Pricing 1: 1=0.1, 10=0.044, 100=0.0178, 1000=0.00802, 2500=0.00696 (USD); Packaging: Digi-Reel®; Part Status: Active; Tolerance: ±1%; Composition: Thick Film; Features: Automotive AEC-Q200; Operating Temperature: -55°C ~ 155°C; Package / Case: 0805 (2012 Metric); Supplier Device Package: 0805; Size / Dimension: 0.079" L x 0.049" W (2.00mm x 1.25mm); Height - Seated (Max): 0.020" (0.50mm); Failure Rate: -; ComponentLink1URL: http://www.vishay.com/docs/20035/dcrcwe3.pdf; ComponentLink1Description: http://www.vishay.com/docs/20035/dcrcwe3.pdf
R7 = CMP-1013-00017-1: Manufacturer: Vishay; Manufacturer Part Number: CRCW0805100KFKEA; Temperature Coefficient: 100ppm/°C; Power Rating: 125mW; Voltage Rating: 150V; Supplier 1: Avnet; Supplier Part Number 1: CRCW0805100KFKEA/BKN; Stock 1: 1317; Pricing 1: 1=0.1, 10=0.049, 25=0.042, 50=0.035, 100=0.028 (USD); Mount: Surface Mount; Case/Package: 0805; Number of Pins: 2; Weight: 0.000194oz; Contact Plating: Tin; Case Code (Imperial): 0805; Case Code (Metric): 2012; Min Operating Temperature: -55°C; Max Operating Temperature: 155°C; Tolerance: 1%; Composition: Thick Film; Termination: SMD/SMT; Packaging: Tape and Reel; Package Quantity: 5000; Military Standard: Not; Voltage Rating (DC): 150V; Length: 2mm; Height: 0.45mm; Width: 1.25mm; Depth: 1.25mm; Radiation Hardening: No; Lead Free: Lead Free; REACH SVHC: Unknown; ComponentLink1URL: https://datasheet.ciiva.com/11809/0900766b80d98b26-11809057.pdf; ComponentLink1Description: https://datasheet.ciiva.com/11809/0900766b80d98b26-11809057.pdf; ComponentLink2URL: https://datasheet.ciiva.com/7777/1697337-7777349.pdf; ComponentLink2Description: https://datasheet.ciiva.com/7777/1697337-7777349.pdf; ComponentLink3URL: https://datasheet.ciiva.com/3258/dcrcwe3-3258006.pdf; ComponentLink3Description: https://datasheet.ciiva.com/3258/dcrcwe3-3258006.pdf; ComponentLink4URL: https://datasheet.ciiva.com/16754/70201119-16754822.pdf; ComponentLink4Description: https://datasheet.ciiva.com/16754/70201119-16754822.pdf; ComponentLink5URL: https://datasheet.ciiva.com/8337/dcrcwe3-8337738.pdf; ComponentLink5Description: https://datasheet.ciiva.com/8337/dcrcwe3-8337738.pdf; ComponentLink6URL: https://datasheet.ciiva.com/16341/dcrcwe3-16341530.pdf; ComponentLink6Description: https://datasheet.ciiva.com/16341/dcrcwe3-16341530.pdf; ComponentLink7URL: https://datasheet.ciiva.com/16852/dcrcwe3-16852810.pdf; ComponentLink7Description: https://datasheet.ciiva.com/16852/dcrcwe3-16852810.pdf; ComponentLink8URL: https://datasheet.ciiva.com/16720/70201119-16720891.pdf; ComponentLink8Description: https://datasheet.ciiva.com/16720/70201119-16720891.pdf; ComponentLink9URL: https://datasheet.ciiva.com/7777/1720486-7777565.pdf; ComponentLink9Description: https://datasheet.ciiva.com/7777/1720486-7777565.pdf
U1 = CMP-0491-01698-1: IC REG BOOST ADJ 0.3A TSOT23-6; Manufacturer 1: Linear Technology; Manufacturer Part Number 1: LT3461AES6#TRMPBF; Category 1: Integrated Circuits (ICs); Function: Step-Up; Output Configuration: Positive; Output Type: Adjustable; Number of Outputs: 1; Voltage - Input (Min): 2.5V; Voltage - Input (Max): 16V; Voltage - Output (Min/Fixed): 1.255V; Voltage - Output (Max): 38V; Current - Output: 300mA (Switch); Frequency - Switching: 3MHz; Synchronous Rectifier: No; Supplier 1: Digi-Key; Supplier Part Number 1: LT3461AES6#TRMPBFCT-ND; RoHS 1: RoHS Compliant; Description 1: IC REG BOOST ADJ 0.3A TSOT23-6; Stock 1: 1325; Pricing 1: 1=3.94, 25=3.52, 100=2.4, 250=2.2 (USD); Packaging: Cut Tape (CT); Part Status: Active; Topology: Boost; Operating Temperature: 0°C ~ 70°C (TA); Mounting Type: Surface Mount; Package / Case: SOT-23-6 Thin, TSOT-23-6; Supplier Device Package: TSOT-23-6; ComponentLink1URL: http://www.linear.com/docs/3469; ComponentLink1Description: http://www.linear.com/docs/3469
U3 = CCG302412S: IC CONV DC-DC 15W DUAL 5V PCB; Manufacturer 1: TDK-Lambda Americas Inc.; Category 1: Power Supplies - Board Mount; Number of Outputs: 2; Voltage - Input (Min): 9V; Voltage - Input (Max): 36V; Voltage - Output 2: -5V; Current - Output (Max): 1.5A, 1.5A; Voltage - Isolation: 1.6kV (1600V); Efficiency: 85%; Supplier 1: Digi-Key; Supplier Part Number 1: 285-1902-ND; Manufacturer Part Number 1: PXB15-24WD05/N; RoHS 1: RoHS Compliant; Description 1: IC CONV DC-DC 15W DUAL 5V PCB; Stock 1: 28; Pricing 1: 1=61.61, 10=59.59 (USD); Packaging: Tube; Part Status: Active; Type: Isolated Module; Voltage - Output 1: 5V; Voltage - Output 3: -; Power (Watts): 15W; Applications: ITE (Commercial); Features: Remote On/Off, OCP, OVP, SCP; Operating Temperature: -40°C ~ 85°C; Mounting Type: Through Hole; Package / Case: 6-DIP Module; Size / Dimension: 1.00" L x 1.00" W x 0.39" H (25.4mm x 25.4mm x 9.9mm); ComponentLink1URL: http://us.tdk-lambda.com/ftp/AppNotes/pxb15w-d_appnote.pdf; ComponentLink1Description: http://us.tdk-lambda.com/ftp/AppNotes/pxb15w-d_appnote.pdf
U5 = CMP-0809-00005-2: Precision, Low Noise, Rail-to-Rail Output, Zero-Drift Operational Amplifier, 4 to 36 V, -40 to 125 degC, 5-pin SOT23 (DBV5), Green (RoHS & no Sb/Br); Manufacturer: Texas Instruments; Total Supply Voltage(Min)(+5V is 5, +/-5V is 10): 4; Offset Drift(Typ)(uV/C): 0.03; Rating: Catalog; SubFamily: Zero Drift Precision Amplifier; GBW(Typ)(MHz): 2; Slew Rate(Typ)(V/us): 0.8; Number of Channels: 1; CMRR(Min)(dB): 120; Iq per channel(Max)(mA): 0.51; Total Supply Voltage(Max)(+5V is 5, +/-5V is 10): 36; PartNumber: OPA188AIDBVR; ComponentLink2Description: Datasheet; ComponentLink2URL: http://www.ti.com/lit/ds/symlink/opa188.pdf; ComponentLink1Description: Manufacturer URL; Mounting Technology: Surface Mount; Eco-Plan: Green (RoHS & no Sb/Br); ComponentLink1URL: http://www.ti.com/; PackageVersion: 4073253-4/K, 03/2006; DatasheetVersion: SBOS642A; ComponentLink3Description: Package Specification; PackageReference: DBV0005A; ComponentLink3URL: http://www.ti.com/litv/pdf/mpds018i; PackageDescription: 5-Pin Plastic Small Outline, Body 1.6 x 2.9 mm, Pitch 0.95 mm; Code_JEDEC: MO-178
U6#1 = CCG302412S: DC/DC CONVERTER 12V 2.5A PCB; Power (Watts) - Manufacture Series: 30W; Manufacturer 1: TDK-Lambda Americas Inc; Number of Outputs: 1; Voltage - Input (Min): 9V; Voltage - Input (Max): 36V; Voltage - Isolation: 1.5kV (1500V); Efficiency: 89%; Category 1: Power Supplies - Board Mount; Packaging: Tube; Type: Isolated Module; Voltage - Output 1: 12V; Voltage - Output 2: -; Voltage - Output 3: -; Current - Output (Max): 2.5A; Features: Remote On/Off, OCP; Mounting Type: Through Hole; Package / Case: 6-DIP Module (6 Leads); Size / Dimension: 1.00" L x 1.00" W x 0.39" H (25.4mm x 25.4mm x 9.9mm); Operating Temperature: -40°C ~ 85°C; Power (Watts) - Max: 30W; ComponentLink1URL: http://www.us.tdk-lambda.com/ftp/specs/ccg30.pdf; ComponentLink1Description: http://www.us.tdk-lambda.com/ftp/specs/ccg30.pdf; Supplier 1: Digi-Key; Supplier Part Number 1: 285-2419-ND; Manufacturer Part Number 1: CCG302412S; RoHS 1: RoHS Compliant; Description 1: DC/DC CONVERTER 12V 2.5A PCB; Stock 1: 30; Pricing 1: 1=43.63, 10=42.95 (USD)
U4 = CC1R5-0505SR-E: Supplier 1: Digi-Key; Supplier Part Number 1: 445-3267-ND